# EasyEDA schematic D1_2020-10-05_14-30-49.json
TITLE: SmartWatch; REV: 1.0; Date: 2017-10-20; Sheet: 1/1; Drawn By: Jake Drew
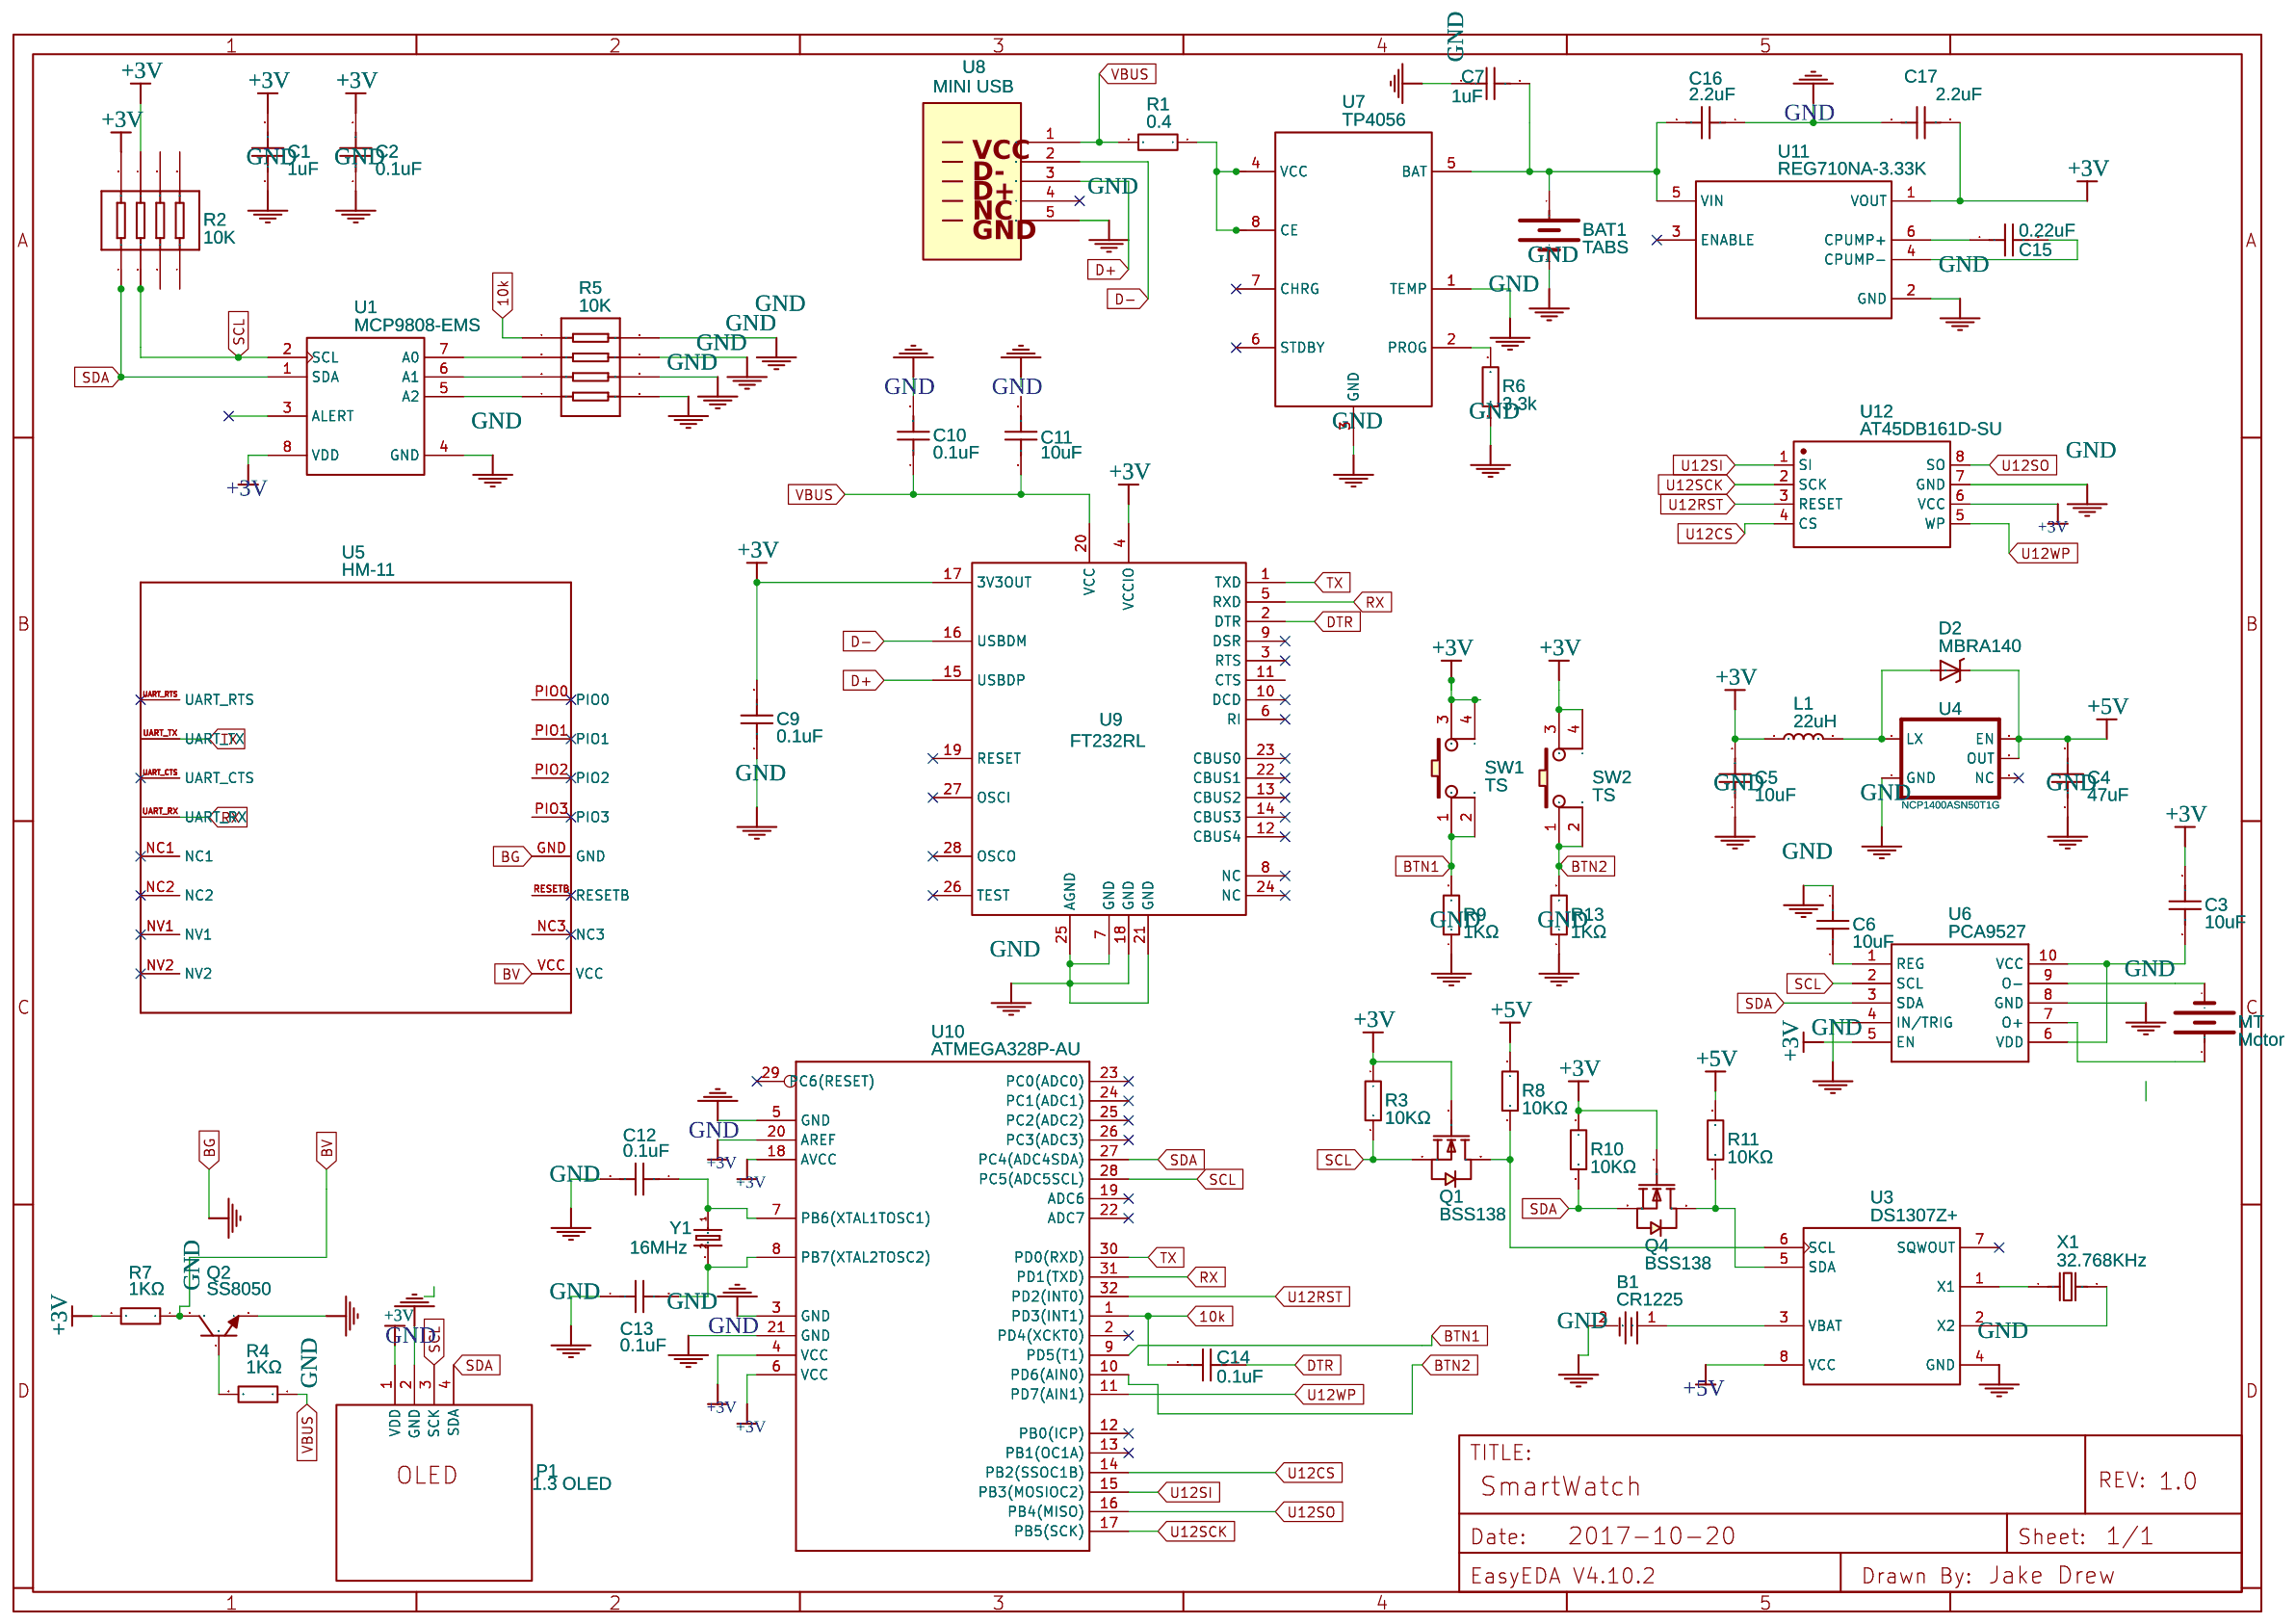
[diagram p0: schematic sheet]

## Parts
B1  CR1225  [CR1225 WITH TAB]
BAT1  TABS  [LIPO-110-TABS]
C1  1uF  [0805]
C2  0.1uF  [0805]
C3  10uF  [0805]
C4  47uF  [0805]
C5  10uF  [0805]
C6  10uF  [0805]
C7  1uF  [0805]
C9  0.1uF  [0805]
C10  0.1uF  [0805]
C11  10uF  [0805]
C12  0.1uF  [0805]
C13  0.1uF  [0805]
C14  0.1uF  [0805]
C15  0.22uF  [0805]
C16  2.2uF  [0805]
C17  2.2uF  [0805]
D2  MBRA140  [SMA-DIODE]
L1  22uH  [SMD-2P-2.0X1.2X1.0MM]
MT  Motor  [LIPO-110-TABS]
P1  1.3 OLED  [1.3 OLED]
Q1  BSS138  [SOT-23-3]
Q2  SS8050  [SOT-23(SOT-23-3)]
Q4  BSS138  [SOT-23-3]
R1  0.4  [0805]
R2  10K  [0603_X4]
R3  10KΩ  [1206]
R4  1KΩ  [1206]
R5  10K  [0603_X4]
R6  3.3k  [1210]
R7  1KΩ  [1206]
R8  10KΩ  [1206]
R9  1KΩ  [1206]
R10  10KΩ  [1206]
R11  10KΩ  [1206]
R13  1KΩ  [1206]
SW1  TS  [SWITCH-6X6X5_TH]
SW2  TS  [SWITCH-6X6X5_TH]
U1  MCP9808-EMS  [MSOP8]
U3  DS1307Z+  [SOIC-8_150MIL]
U4  NCP1400ASN50T1G  [SOT23-5]
U5  HM-11  [HM-11]
U6  PCA9527  [TSSOP10]
U7  TP4056  [SOP-8_EP_150MIL]
U8  MINI USB  [USB-MINI-B]
U9  FT232RL  [SSOP-28_208MIL]
U10  ATMEGA328P-AU  [TQFP32-0.8-7X7MM]
U11  REG710NA-3.33K  [SOT-23-6]
U12  AT45DB161D-SU  [SOIC-8]
X1  32.768KHz  [3*8]
Y1  16MHz  [X2-SMD-5.0X3.2X1.3MM]

## Library data of the parts
B1 = -: Manufacturer: QJ; Manufacturer Part: CR1220-2
BAT1 MT = -: Battery Holders; catid: 20; Contributor: SparkFun; Manufacturer Part: ?
C1-C7 C9-C17 = -: Voltage: 25V; Tolerance: ±10%; Supplier: LCSC; Manufacturer: FH(风华); Manufacturer Part: 0805B105K250NT; Supplier Part: C89190
D2 = -: catid: 20; Contributor: SparkFun; Manufacturer Part: ?
L1 = -: SMD Inductor 22uH-10%;; catid: 20; Manufacturer Part: SDFL2012T220KTF
P1 = -: catid: 20; sourceId: 1T5FDZYC8; Supplier: Aliexpress; Manufacturer Part: ?
Q1 Q4 = -: Supplier: LCSC; Manufacturer: CJ; Supplier Part: C78284
Q2 = -: Supplier: LCSC; Manufacturer: CJ; LCSC Assembly: Yes; Supplier Part: C2150
R1 = -: Power: 1/8W; Tolerance: ±1%; Supplier: LCSC; Manufacturer: UniOhm; Manufacturer Part: 0805W8F147KT5E; Supplier Part: C68930
R2 R5 = -: Tolerance: ±5%; Supplier: LCSC; Manufacturer: UniOhm; Manufacturer Part: 4D03WGJ0102T5E; LCSC Assembly: Yes; Supplier Part: C20197
R3 R8 R10 R11 = -: Power: 1/4W; Tolerance: ±1%; Supplier: LCSC; Manufacturer: UniOhm; Manufacturer Part: 1206W4F1002T5E; LCSC Assembly: Yes; Supplier Part: C17902
R4 R7 R9 R13 = -: Power: 1/4W; Tolerance: ±1%; Supplier: LCSC; Manufacturer: UniOhm; Manufacturer Part: 1206W4F1001T5E; LCSC Assembly: Yes; Supplier Part: C4410
R6 = -: Power: 1/3W; Tolerance: ±1%; Supplier: LCSC; Manufacturer: UniOhm; Manufacturer Part: 1210W3F680KT5E; Supplier Part: C38887
SW1 SW2 = -: Supplier: LCSC; Manufacturer: LCSC; Manufacturer Part: SWITCH-6x6x5_TH; Supplier Part: C69330
U1 = -: +  - 0.5 degC Maximum Accuracy Digital Temperature Sensor, 400 uA, 2.7 to 5.5 V, -40 to 125 degC, 8-pin MSOP (MS8), Tube; catid: 20; Manufacturer Part: ?
U3 = -: catid: 20; Supplier: LCSC; Manufacturer: MAXIM; Manufacturer Part: DS1307Z+T&R; Supplier Part: C9868
U4 = -: Switching step-up voltage regulator; catid: 20; Contributor: SparkFun; Manufacturer Part: ?
U5 = -: null; catid: 20; Manufacturer Part: ?
U6 U8 = -: catid: 20; Manufacturer Part: ?
U7 = -: Contributor: Guest; Supplier: LCSC; Manufacturer: TOPPOWER; LCSC Assembly: Yes; Supplier Part: C16581
U9 = -: catid: 20; Supplier: LCSC; Manufacturer: FTDI; Manufacturer Part: FT232RL-REEL; LCSC Assembly: Yes; Supplier Part: C8690
U10 = -: IC MCU 8Bit 32KB ISP flash 20MHz  1.8v-5.5v; catid: 20
U11 = -: 3.3 V, Buck  Boost Charge Pump, 30 mA, 1.8 to 5.5 V Input, -40 to 85 degC, 6-pin SOT23 (DBV6), Green (RoHS  no SbBr); catid: 20; Manufacturer Part: ?
U12 = -: Manufacturer Part: ?
X1 = -: Supplier: LCSC; Manufacturer: KDS; Manufacturer Part: DT-38 32.768KHz; Supplier Part: C93228
Y1 = -: SMD 16MHz-8pF-20ppm-40R; catid: 20; Manufacturer Part: X053201602002

## Nets
+3V: C1.2 C2.2 C3.2 C5.2 C9.2 C17.2 L1.1 P1.1(VDD) Q1.1(G) Q4.1(G) R2.7 R2.8 R3.1 R7.2 R10.1 SW1.3 SW1.4 SW2.3 SW2.4 U1.8(VDD) U6.5(EN) U9.4(VCCIO) U9.17(3V3OUT) U10.4(VCC) U10.6(VCC) U10.18(AVCC) U10.20(AREF) U11.1(VOUT) U12.6(VCC)
+5V: C4.2 D2.C R8.2 R11.2 U3.8(VCC) U4.1(EN) U4.2(OUT)
VBUS: C10.1 C11.1 R1.2 R4.1 U8.1 U9.20(VCC)
10k: C14.2 R5.1 U10.1(PD3(INT1))
BG: B1.2 BAT1.- C1.1 C2.1 C4.1 C5.1 C6.2 C7.1 C9.1 C10.2 C12.2 C13.1 C16.1 C17.1 P1.2(GND) Q2.2(E) R5.5 R5.6 R5.7 R5.8 R6.1 R9.1 R13.1 U1.4(GND) U3.4(GND) U4.4(GND) U5.GND U6.4(IN/TRIG) U6.8(GND) U7.1(TEMP) U7.3(GND) U8.5 U9.7(GND) U9.18(GND) U9.21(GND) U9.25(AGND) U10.3(GND) U10.5(GND) U10.21(GND) U11.2(GND) U12.7(GND)
BTN1: R9.2 SW1.1 SW1.2 U10.9(PD5(T1))
BTN2: R13.2 SW2.1 SW2.2 U10.10(PD6(AIN0))
BV: Q2.3(C) R7.1 U5.VCC
D+: U8.3 U9.15(USBDP)
D-: U8.2 U9.16(USBDM)
DTR: C14.1 U9.2(DTR)
RX: U5.UART_RX U9.5(RXD) U10.31(PD1(TXD))
SCL: P1.3(SCK) Q1.2(S) R2.2 R3.2 U1.2(SCL) U6.2(SCL) U10.28(PC5(ADC5SCL))
SDA: P1.4(SDA) Q4.2(S) R2.1 R10.2 U1.1(SDA) U6.3(SDA) U10.27(PC4(ADC4SDA))
TX: U5.UART_TX U9.1(TXD) U10.30(PD0(RXD))
U12CS: U10.14(PB2(SSOC1B)) U12.4(CS)
U12RST: U10.32(PD2(INT0)) U12.3(RESET)
U12SCK: U10.17(PB5(SCK)) U12.2(SCK)
U12SI: U10.15(PB3(MOSIOC2)) U12.1(SI)
U12SO: U10.16(PB4(MISO)) U12.8(SO)
U12WP: U10.11(PD7(AIN1)) U12.5(WP)
Net-(B1-1): B1.1 U3.3(VBAT)
Net-(BAT1-+): BAT1.+ C7.2 C16.2 U7.5(BAT) U11.5(VIN)
Net-(C3-1): C3.1 U6.6(VDD) U6.10(VCC)
Net-(C6-1): C6.1 U6.1(REG)
Net-(C12-1): C12.1 U10.7(PB6(XTAL1TOSC1)) Y1.1
Net-(C13-2): C13.2 U10.8(PB7(XTAL2TOSC2)) Y1.2
Net-(C15-1): C15.1 U11.6(CPUMP+)
Net-(C15-2): C15.2 U11.4(CPUMP-)
Net-(D2-A): D2.A L1.2 U4.5(LX)
Net-(MT-+): MT.+ U6.7(O+)
Net-(MT--): MT.- U6.9(O-)
Net-(Q1-3): Q1.3(D) R8.1 U3.6(SCL)
Net-(Q2-1): Q2.1(B) R4.2
Net-(Q4-3): Q4.3(D) R11.1 U3.5(SDA)
Net-(R1-1): R1.1 U7.4(VCC) U7.8(CE)
Net-(R5-2): R5.2 U1.7(A0)
Net-(R5-3): R5.3 U1.6(A1)
Net-(R5-4): R5.4 U1.5(A2)
Net-(R6-2): R6.2 U7.2(PROG)
Net-(U3-1): U3.1(X1) X1.1
Net-(U3-2): U3.2(X2) X1.2

Not connected (* = marked no-connect by the designer): C11 2; R2 3 4 5 6; U1 3(ALERT); U3 7(SQWOUT)*; U4 3(NC)*; U5 NC1* NC2* NC3 NV1* NV2* PIO0 PIO1 PIO2 PIO3 RESETB UART_CTS* UART_RTS*; U7 6(STDBY)* 7(CHRG)*; U8 4*; U9 3(RTS)* 6(RI)* 8(NC)* 9(DSR)* 10(DCD)* 11(CTS) 12(CBUS4)* 13(CBUS2)* 14(CBUS3)* 19(RESET)* 22(CBUS1)* 23(CBUS0)* 24(NC)* 26(TEST)* 27(OSCI)* 28(OSCO)*; U10 2(PD4(XCKT0))* 12(PB0(ICP))* 13(PB1(OC1A))* 19(ADC6)* 22(ADC7)* 23(PC0(ADC0))* 24(PC1(ADC1))* 25(PC2(ADC2))* 26(PC3(ADC3))* 29(PC6(RESET))*; U11 3(ENABLE)*
